# EAGLE design Schematic_11_2017 - 3Layersv7.2 (EAGLE 9.4.2)
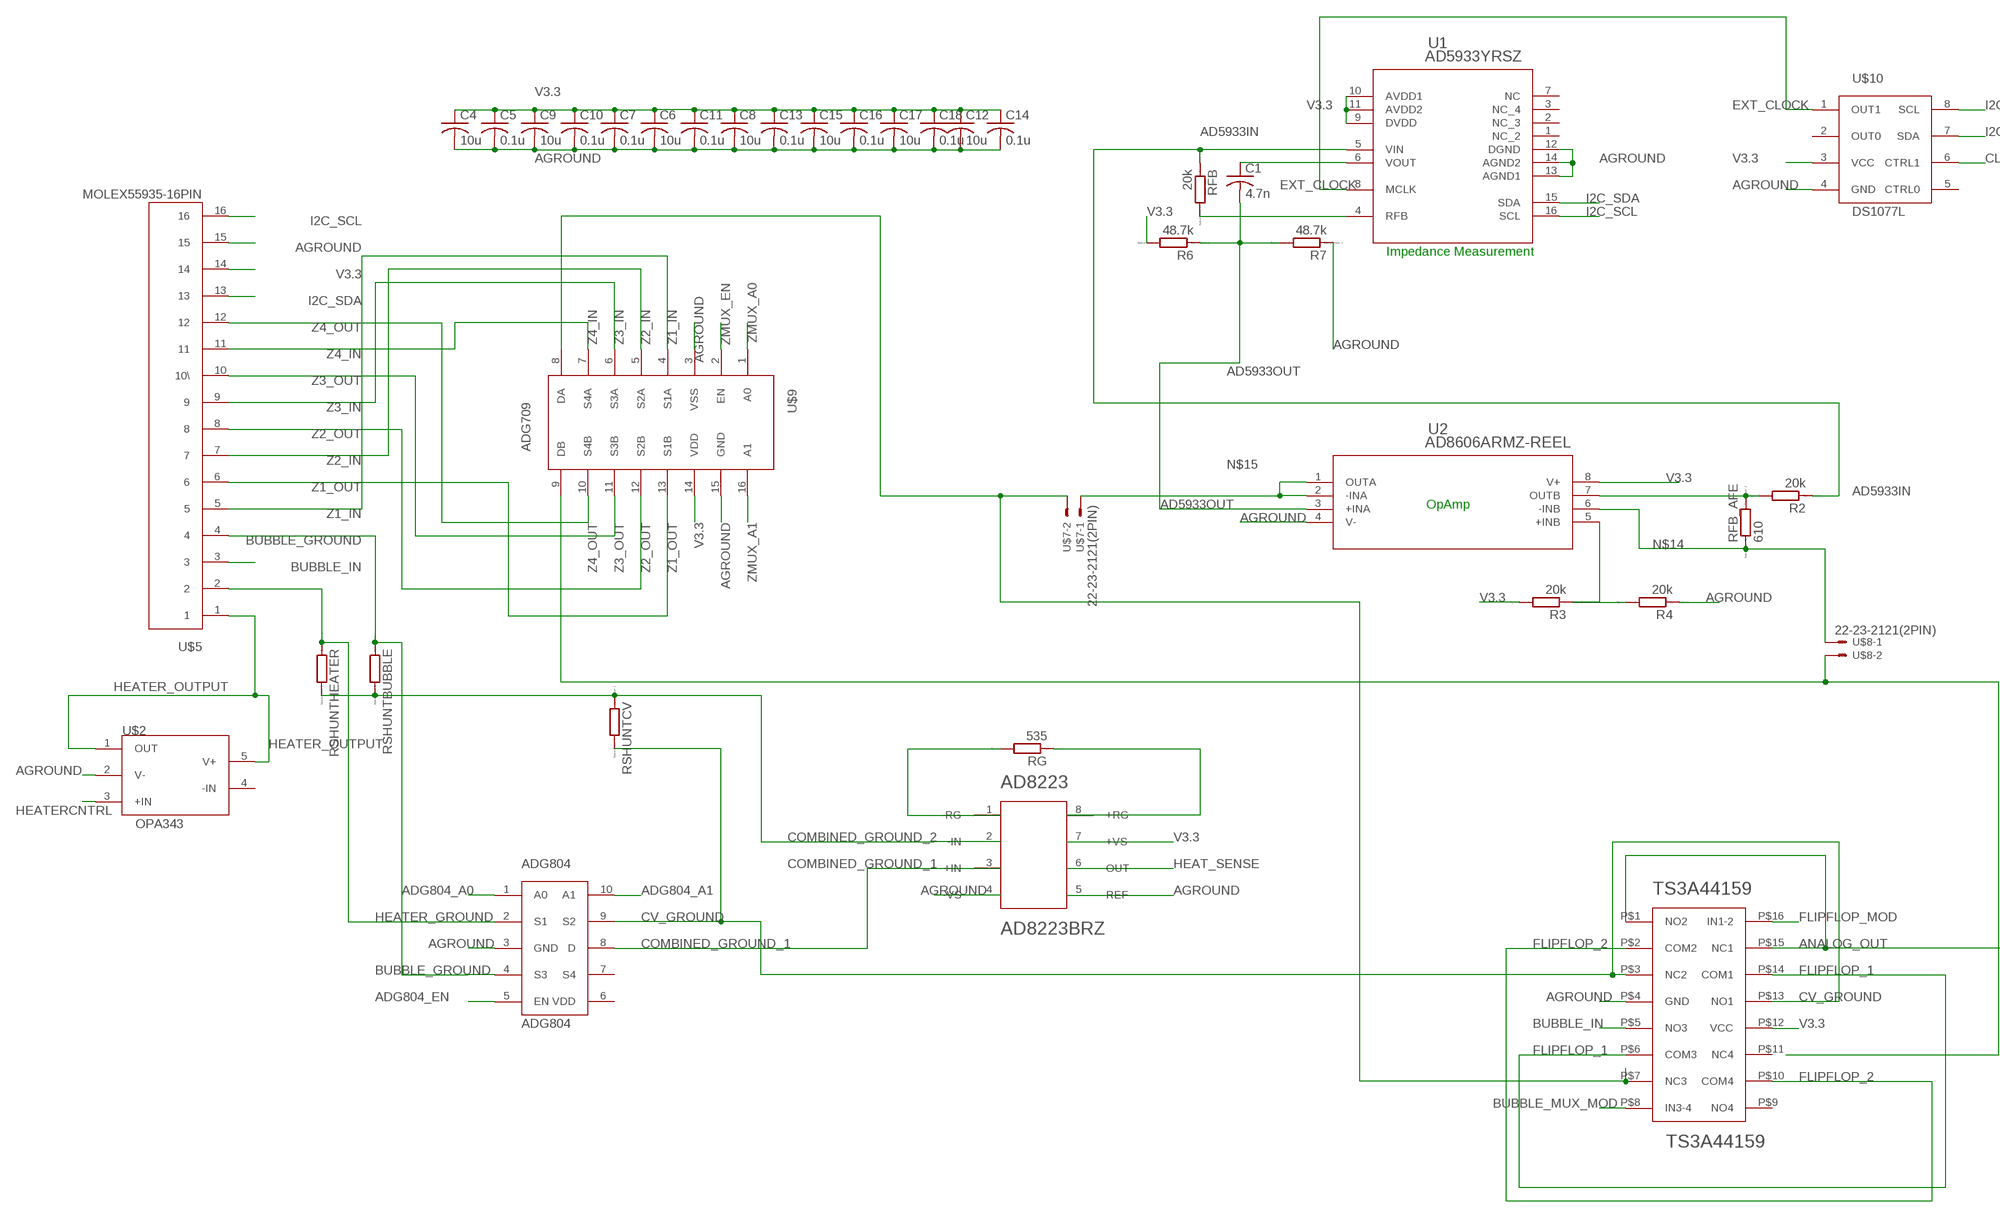
[diagram p0: schematic, sheet 1, part 1 of 2]
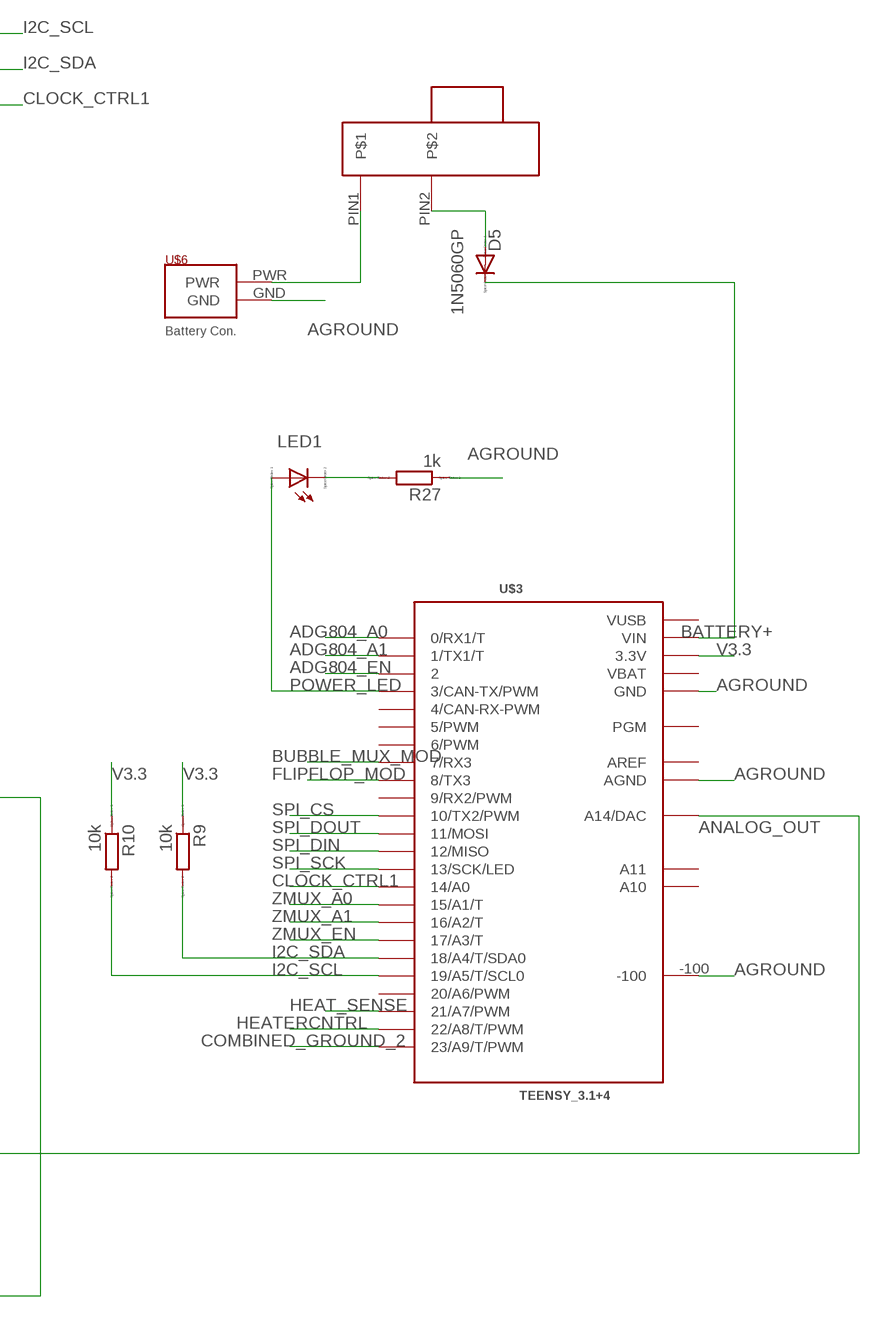
[diagram p1: schematic, sheet 1, part 2 of 2]

## Parts
ADG804  ADG804  [MSOP10]
C1  4.7n  C-USC1206  [C1206]
C4  10u  C-USC1206  [C1206]
C5  0.1u  C-USC1206  [C1206]
C6  10u  C-USC1206  [C1206]
C7  0.1u  C-USC1206  [C1206]
C8  10u  C-USC1206  [C1206]
C9  10u  C-USC1206  [C1206]
C10  0.1u  C-USC1206  [C1206]
C11  0.1u  C-USC1206  [C1206]
C12  10u  C-USC1206  [C1206]
C13  0.1u  C-USC1206  [C1206]
C14  0.1u  C-USC1206  [C1206]
C15  10u  C-USC1206  [C1206]
C16  0.1u  C-USC1206  [C1206]
C17  10u  C-USC1206  [C1206]
C18  0.1u  C-USC1206  [C1206]
D5  1N5060GP  [DO15-12]
LED1  LED_ELD260  [LED_LD260]
R2  20k  RR1206  [R1206]
R3  20k  RR1206  [R1206]
R4  20k  RR1206  [R1206]
R6  48.7k  RR1206  [R1206]
R7  48.7k  RR1206  [R1206]
R9  10k  RR1206  [R1206]
R10  10k  RR1206  [R1206]
R27  1k  RR1206  [R1206]
RFB  20k  RR1206  [R1206]
RFB_AFE  610  RR1206  [R1206]
RG  535  RR1206  [R1206]
RSHUNTBUBBLE  RR1206  [R1206]
RSHUNTCV  RR1206  [R1206]
RSHUNTHEATER  RR1206  [R1206]
TS3A44159  TS3A44159  [TSSOP16]
U1  AD5933YRSZ  [RS_16]
U2  AD8606ARMZ-REEL  [RM_8]
U$1  AD8223BRZ  [R-8]
U$2  OPA343  [SOT95P280X145-5N]
U$3  TEENSY_3.1+4  [TEENSY_3.1+4]
U$4  C&KSWITCH  [2POS_SWITCH]
U$5  MOLEX55935-16PIN  [MOLEX55935-16PIN]
U$6  PH_2PIN  [JST_PH_2PIN]
U$7  22-23-2121(2PIN)  [22-23-2121(2PIN)]
U$8  22-23-2121(2PIN)  [22-23-2121(2PIN)]
U$9  ADG709  [TSSOP16]
U$10  DS1077L  [SO08]

## Nets
AD5933IN: R2.1 RFB.1 U1.5(VIN)
AD5933OUT: C1.2 R6.1 R7.2 U2.3(+INA)
ADG804_A0: ADG804.1(A0) U$3.0(0/RX1/T)
ADG804_A1: ADG804.10(A1) U$3.1(1/TX1/T)
ADG804_EN: ADG804.5(EN) U$3.2
AGROUND: ADG804.3(GND) C4.2 C5.2 C6.2 C7.2 C8.2 C9.2 C10.2 C11.2 C12.2 C13.2 C14.2 C15.2 C16.2 C17.2 C18.2 R4.1 R7.1 R27.1 TS3A44159.P$4(GND) U1.12(DGND) U1.13(AGND1) U1.14(AGND2) U2.4(V-) U$1.4(-VS) U$1.5(REF) U$2.2(V-) U$3.-100 U$3.AGND U$3.GND1(GND) U$5.15 U$6.GND U$9.3(VSS) U$9.15(GND) U$10.4(GND)
ANALOG_OUT: TS3A44159.P$1(NO2) TS3A44159.P$15(NC1) U$3.A14(A14/DAC)
BATTERY+: D5.C U$3.VIN
BUBBLE_GROUND: ADG804.4(S3) RSHUNTBUBBLE.1 U$5.4
BUBBLE_IN: TS3A44159.P$5(NO3) U$5.3
BUBBLE_MUX_MOD: TS3A44159.P$8(IN3-4) U$3.7(7/RX3)
CLOCK_CTRL1: U$3.14/A0 U$10.6(CTRL1)
COMBINED_GROUND_1: ADG804.8(D) U$1.3(+IN)
COMBINED_GROUND_2: RSHUNTBUBBLE.2 RSHUNTCV.1 RSHUNTHEATER.2 U$1.2(-IN) U$3.23/A9(23/A9/T/PWM)
CV_GROUND: ADG804.9(S2) RSHUNTCV.2 TS3A44159.P$3(NC2) TS3A44159.P$13(NO1)
EXT_CLOCK: U1.8(MCLK) U$10.1(OUT1)
FLIPFLOP_1: TS3A44159.P$6(COM3) TS3A44159.P$14(COM1)
FLIPFLOP_2: TS3A44159.P$2(COM2) TS3A44159.P$10(COM4)
FLIPFLOP_MOD: TS3A44159.P$16(IN1-2) U$3.8(8/TX3)
HEAT_SENSE: U$1.6(OUT) U$3.21/A7(21/A7/PWM)
HEATER_GROUND: ADG804.2(S1) RSHUNTHEATER.1 U$5.2
HEATER_OUTPUT: U$2.1(OUT) U$2.5(V+) U$5.1
HEATERCNTRL: U$2.3(+IN) U$3.22/A8(22/A8/T/PWM)
I2C_SCL: R10.2 U1.16(SCL) U$3.19/A5(19/A5/T/SCL0) U$5.16 U$10.8(SCL)
I2C_SDA: R9.2 U1.15(SDA) U$3.18/A4(18/A4/T/SDA0) U$5.13 U$10.7(SDA)
N$1: U$4.PIN1 U$6.PWR
N$2: D5.A U$4.PIN2
N$4: RFB.2 U1.4(RFB)
N$5: LED1.K(C) R27.2
N$8: C1.1 U1.6(VOUT)
N$12: R2.2 RFB_AFE.2 U2.7(OUTB)
N$13: R3.1 R4.2 U2.5(+INB)
N$14: RFB_AFE.1 U2.6(-INB) U$8.1
N$15: U2.1(OUTA) U2.2(-INA) U$7.1
N$16: RG.2 U$1.1(-RG)
N$17: RG.1 U$1.8(+RG)
POWER_LED: LED1.A U$3.3(3/CAN-TX/PWM)
SIGNAL+: TS3A44159.P$7(NC3) U$7.2 U$9.8(DA)
SIGNAL-: U$8.2 U$9.9(DB)
SPI_CS: U$3.10(10/TX2/PWM)
SPI_DIN: U$3.12(12/MISO)
SPI_DOUT: U$3.11(11/MOSI)
SPI_SCK: U$3.13(13/SCK/LED)
V3.3: C4.1 C5.1 C6.1 C7.1 C8.1 C9.1 C10.1 C11.1 C12.1 C13.1 C14.1 C15.1 C16.1 C17.1 C18.1 R3.2 R6.2 R9.1 R10.1 TS3A44159.P$12(VCC) U1.9(DVDD) U1.10(AVDD1) U1.11(AVDD2) U2.8(V+) U$1.7(+VS) U$3.3.3V U$3.3.3V1(3.3V) U$5.14 U$9.14(VDD) U$10.3(VCC)
Z1_IN: U$5.5 U$9.4(S1A)
Z1_OUT: U$5.6 U$9.13(S1B)
Z2_IN: U$5.7 U$9.5(S2A)
Z2_OUT: U$5.8 U$9.12(S2B)
Z3_IN: U$5.9 U$9.6(S3A)
Z3_OUT: U$5.10(10\) U$9.11(S3B)
Z4_IN: U$5.11 U$9.7(S4A)
Z4_OUT: U$5.12 U$9.10(S4B)
ZMUX_A0: U$3.15/A1(15/A1/T) U$9.1(A0)
ZMUX_A1: U$3.16/A2(16/A2/T) U$9.16(A1)
ZMUX_EN: U$3.17/A3(17/A3/T) U$9.2(EN)
Unconnected: ADG804.6(VDD) ADG804.7(S4) TS3A44159.P$9(NO4) TS3A44159.P$11(NC4) U1.1(NC_2) U1.2(NC_3) U1.3(NC_4) U1.7(NC) U$2.4(-IN) U$3.4(4/CAN-RX-PWM) U$3.5(5/PWM) U$3.6(6/PWM) U$3.9(9/RX2/PWM) U$3.20/A6(20/A6/PWM) U$3.A10 U$3.A11 U$3.PGM U$10.2(OUT0) U$10.5(CTRL0)

## Notes on the sheet
- Impedance Measurement
- OpAmp

## Power pins joined to a net without a drawn wire
AREF: U$3.AREF
VBAT: U$3.VBAT
VUSB: U$3.VUSB

## Library data of the parts
ADG804 = analog_devices_gaui:ADG804
C1 C4-C18 = resistor:C-US: CAPACITOR, American symbol
D5 = diode:1N5060GP: DIODE controlled avalanche rectifier
LED1 = eagle-ltspice:LED_E: LED Source: http://www.osram.convergy.de Source: www.luxeon.com Source: www.kingbright.com; SPICEMODEL: NONE; SPICEPREFIX: D; SPICETYPE: diode
R2-R4 R6 R7 R9 R10 R27 RFB RFB_AFE RG RSHUNTBUBBLE RSHUNTCV RSHUNTHEATER = eagle-ltspice:R: RESISTOR, European symbol; SPICEMODEL: NONE; SPICEPREFIX: R
TS3A44159 = Z_analyze:TS3A44159
U1 = AD5933-impedance:AD5933YRSZ; MANUFACTURER_PART_NUMBER: AD5933YRSZ; VENDOR: Analog Devices Inc
U2 = AD8606-OpAmp:AD8606ARMZ-REEL; MANUFACTURER_PART_NUMBER: AD8606ARMZREEL; VENDOR: Analog Devices Inc
U$1 = Z_analyze:AD8223BRZ
U$2 = OPA343:OPA343: Rail-to-rail, single supply op amp, Texas Instruments
U$3 = Teensy_3_Series_Board_v1.0:TEENSY_3.1+4: Footprint for Teensy 3.1 board using all through-holes, i.e. the entire perimeter plus the 4 through-holes inboard (A10,A11,AREF, VUSB)
U$4 = 2pos_switch:C&KSWITCH
U$5 = Z_analyze:MOLEX55935-16PIN
U$6 = JST PH Connector:PH_2PIN
U$7 U$8 = con-molex:22-23-2121(2PIN)
U$9 = analog-devices-3 (1):ADG709
U$10 = analog_devices_gaui:DS1077L

## Board
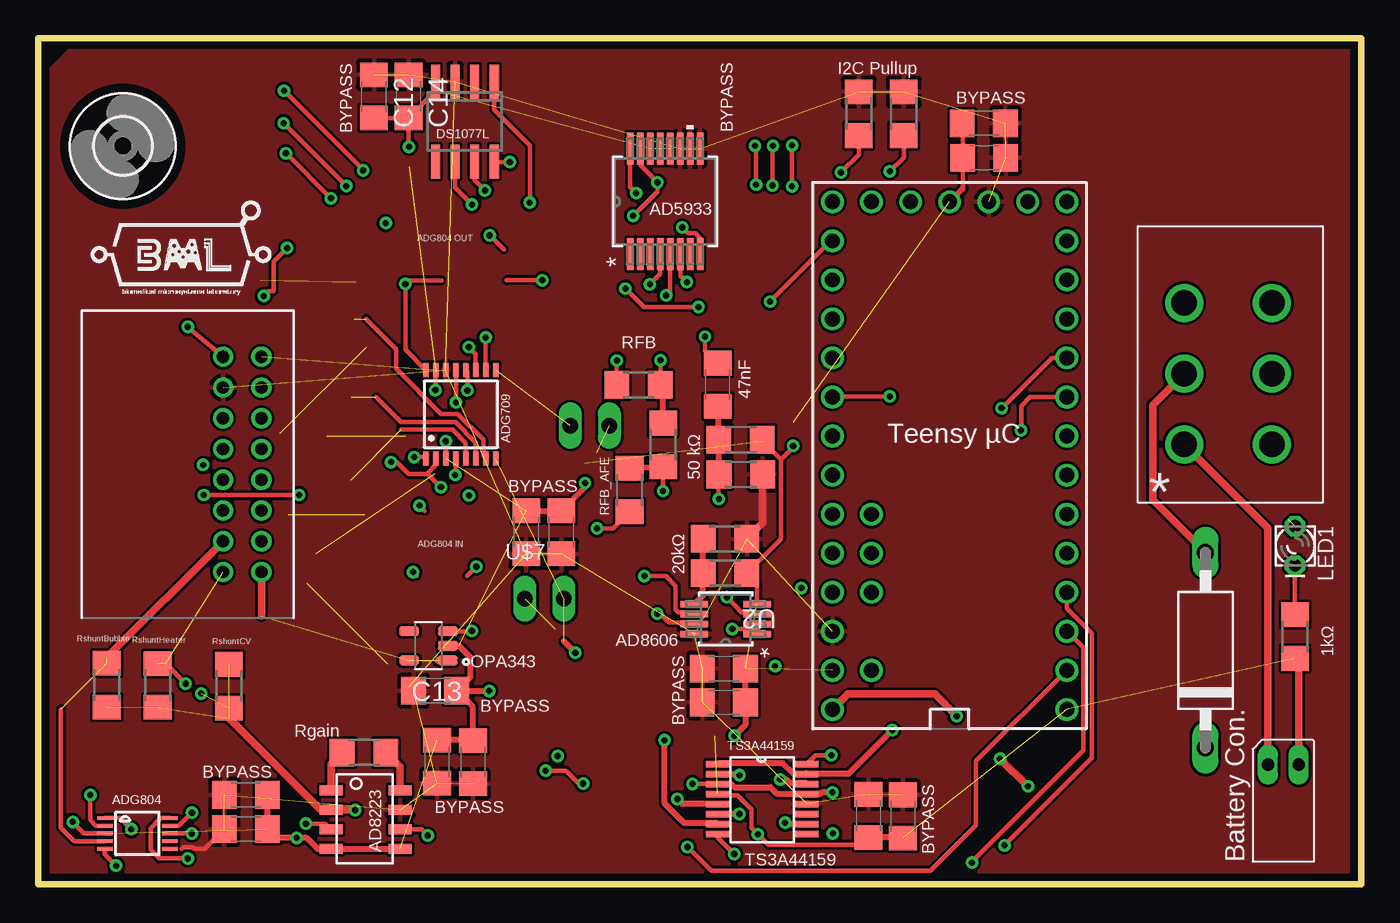
[diagram p2: board, top side]
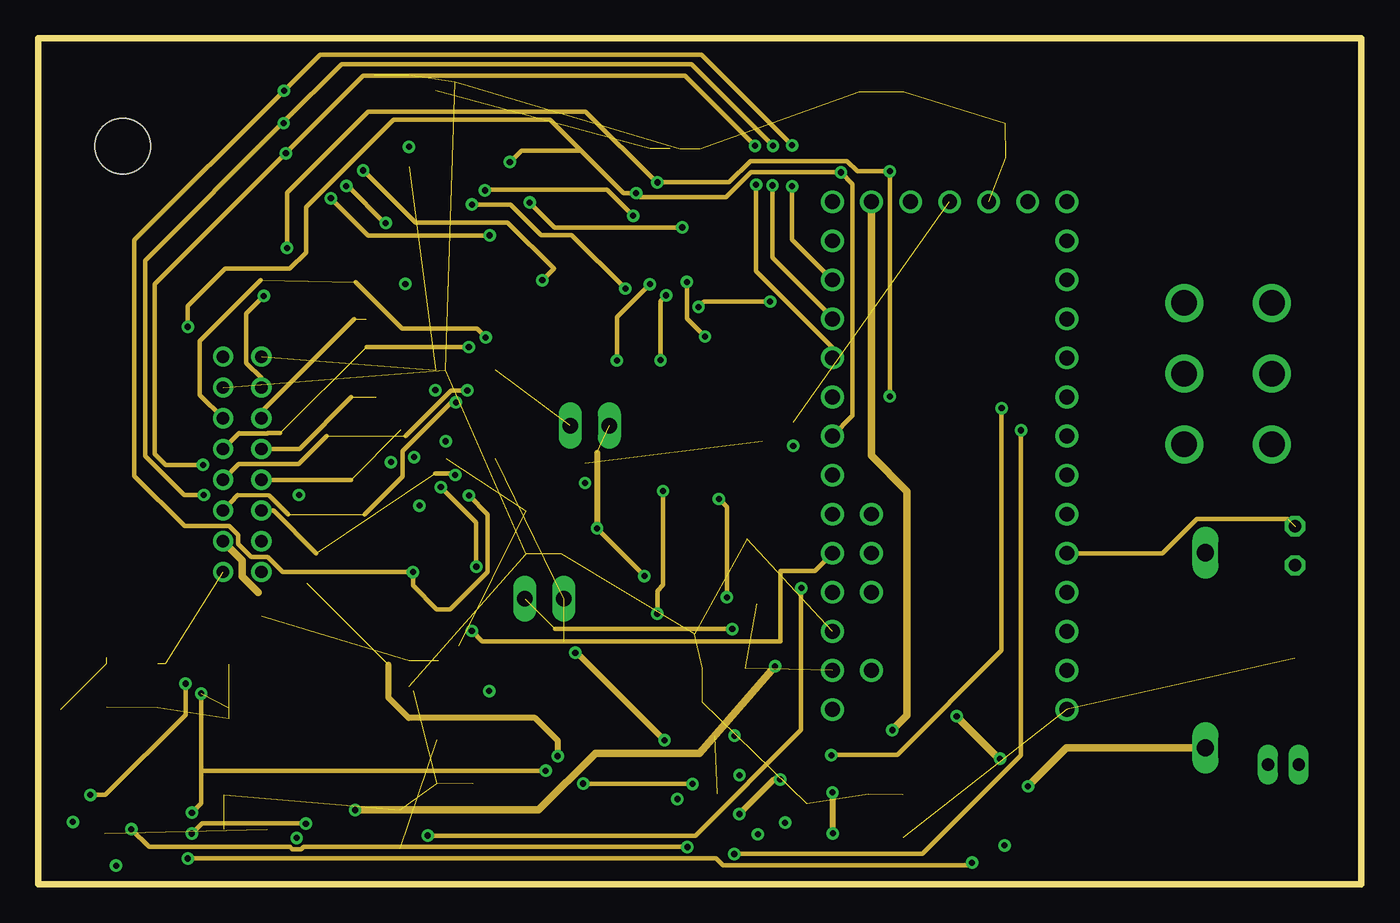
[diagram p3: board, inner layer Signal]
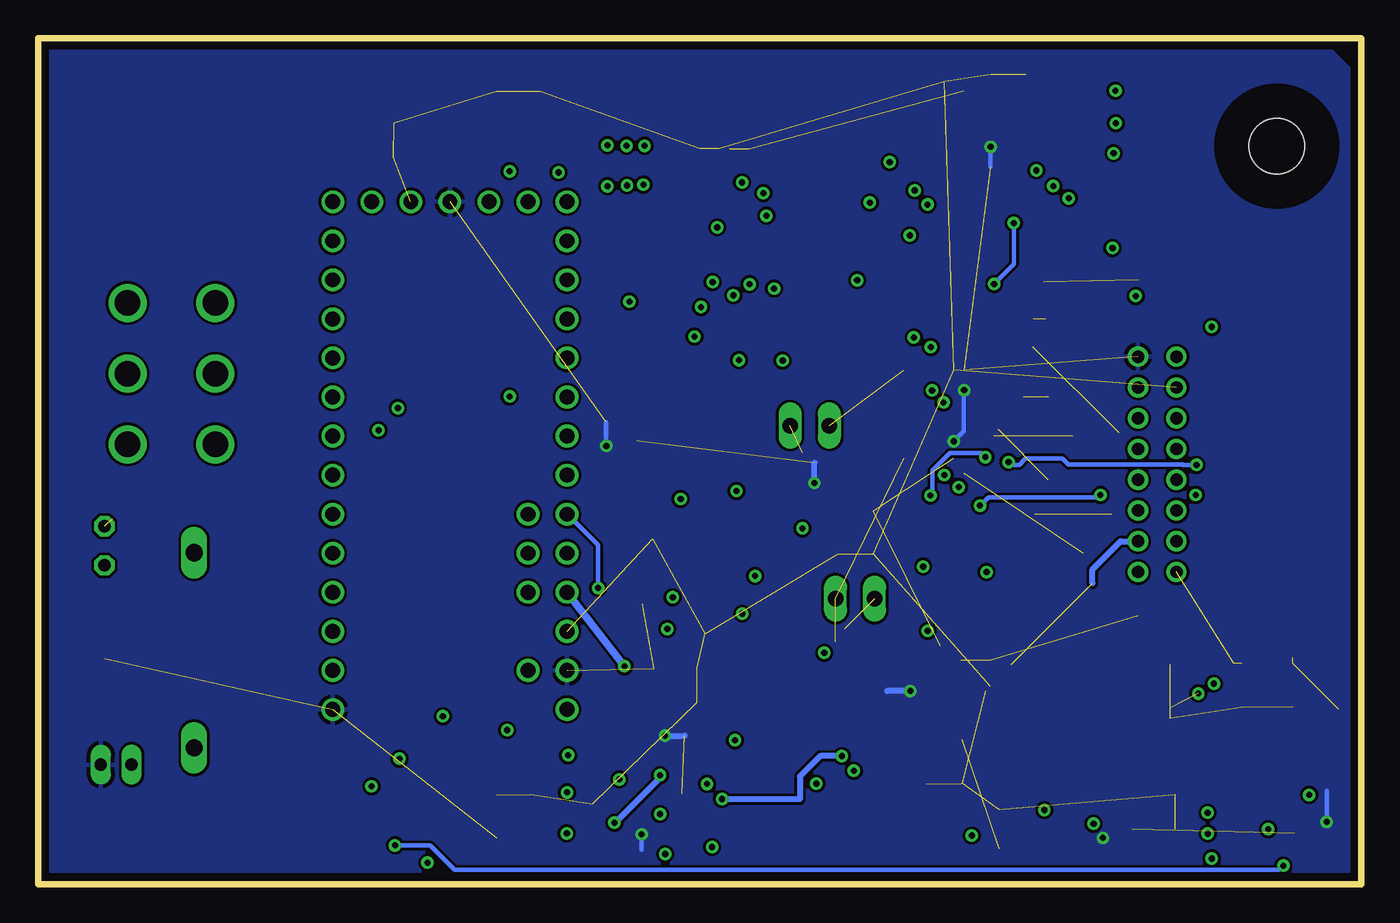
[diagram p4: board, bottom side, seen from below]

Size 86 x 55 mm. Coordinates in mm from the lower left corner, seen from the top.
Outline: 0,0 86,0 86,55 0,55 0,0
Copper layers (1+2*15+16): power 1mm / dielectric 1.5mm / Signal 0mil / dielectric 0.15mm / Route15 0.035mm / dielectric 0.2mm / ground 1mm
Design rules "default *": minimum track width 7mil, minimum drill 15mil, track to track 7mil, track to pad 7mil, pad to pad 7mil, via to via 7mil, smd to smd 4mil, copper to edge 20mil, drill to drill 4mil, minimum pad ring 10mil, minimum via ring 8mil, stop-mask expansion 4mil, vias tented up to drill 0mil, thermal gap 10mil

### Footprints (pad centres in the part's own frame; a part is rotated, then mirrored left to right if it is on the bottom)
MSOP10 = smd 0.25 x 1: 1 -1,-2.113; 2 -0.5,-2.113; 3 0,-2.113; 4 0.5,-2.113; 5 1,-2.113; 6 1,2.113; 7 0.5,2.113; 8 0,2.113; 9 -0.5,2.113; 10 -1,2.113
C1206 = smd 1.6 x 1.8: 1 -1.4,0; 2 1.4,0
DO15-12 = drill 1.118 long: A 6.35,0; C -6.35,0
3,6 = hole 3.6: 0,0
LED_LD260 = drill 0.813 octagon: A -1.27,0; K 1.27,0
R1206 = smd 1.6 x 1.803: 1 -1.422,0; 2 1.422,0
TSSOP16 = smd 1.5 x 0.45: P$1 0,0; P$2 0,-0.65; P$3 0,-1.3; P$4 0,-1.95; P$5 0,-2.6; P$6 0,-3.25; P$7 0,-3.9; P$8 0,-4.55; P$9 5.8,-4.55; P$10 5.8,-3.9; P$11 5.8,-3.25; P$12 5.8,-2.6; P$13 5.8,-1.95; P$14 5.8,-1.3; P$15 5.8,-0.65; P$16 5.8,0
RS_16 = smd 2.057 x 0.432: 1 -3.429,2.275; 2 -3.429,1.625; 3 -3.429,0.975; 4 -3.429,0.325; 5 -3.429,-0.325; 6 -3.429,-0.975; 7 -3.429,-1.625; 8 -3.429,-2.275; 9 3.429,-2.275; 10 3.429,-1.625; 11 3.429,-0.975; 12 3.429,-0.325; 13 3.429,0.325; 14 3.429,0.975; 15 3.429,1.625; 16 3.429,2.275
RM_8 = smd 1.778 x 0.432: 1 -2.045,0.975; 2 -2.045,0.325; 3 -2.045,-0.325; 4 -2.045,-0.975; 5 2.045,-0.975; 6 2.045,-0.325; 7 2.045,0.325; 8 2.045,0.975
R-8 = smd 0.65 x 1.5: 1 0,0; 2 1.27,0; 3 2.54,0; 4 3.81,0; 5 3.81,4.5; 6 2.54,4.5; 7 1.27,4.5; 8 0,4.5
SOT95P280X145-5N = smd 1.27 x 0.635: 1 -1.255,0.95; 2 -1.255,0; 3 -1.255,-0.95; 4 1.255,-0.95; 5 1.255,0.95
TEENSY_3.1+4 = drill 0.965: 0 -7.62,15.24; 1 -7.62,12.7; 2 -7.62,10.16; 3 -7.62,7.62; 3.3V 7.62,12.7; 3.3V1 -2.54,-15.24; 4 -7.62,5.08; 5 -7.62,2.54; 6 -7.62,0; 7 -7.62,-2.54; 8 -7.62,-5.08; 9 -7.62,-7.62; 10 -7.62,-10.16; 11 -7.62,-12.7; 12 -7.62,-15.24; 13 7.62,-15.24; 14/A0 7.62,-12.7; 15/A1 7.62,-10.16; 16/A2 7.62,-7.62; 17/A3 7.62,-5.08; 18/A4 7.62,-2.54; 19/A5 7.62,0; 20/A6 7.62,2.54; 21/A7 7.62,5.08; 22/A8 7.62,7.62; 23/A9 7.62,10.16; -100 -7.62,17.78; A10 5.08,7.62; A11 5.08,5.08; A14 5.08,-15.24; AGND 7.62,15.24; AREF 5.08,10.16; GND1 0,-15.24; PGM 2.54,-15.24; VBAT -5.08,-15.24; VIN 7.62,17.78; VUSB 5.08,15.24
2POS_SWITCH = drill 1.65: P$1 0,0; P$4 5.7,0; P$5 5.7,-4.6; P$6 5.7,-9.2; PIN1 0,-9.2; PIN2 0,-4.6
MOLEX55935-16PIN = drill 0.8: 1 0,0; 2 0,2.5; 3 2,0; 4 2,2.5; 5 4,0; 6 4,2.5; 7 6,0; 8 6,2.5; 9 8,0; 10 8,2.5; 11 10,0; 12 10,2.5; 13 12,0; 14 12,2.5; 15 14,0; 16 14,2.5
JST_PH_2PIN = drill 0.8 long: GND 0,-1; PWR 0,1
22-23-2121(2PIN) = drill 1 long: 1 -13.97,0; 2 -11.43,0
TSSOP16' = smd 0.9 x 0.35: 1 -2.875,2.275; 2 -2.875,1.625; 3 -2.875,0.975; 4 -2.875,0.325; 5 -2.875,-0.325; 6 -2.875,-0.975; 7 -2.875,-1.625; 8 -2.875,-2.275; 9 2.875,-2.275; 10 2.875,-1.625; 11 2.875,-0.975; 12 2.875,-0.325; 13 2.875,0.325; 14 2.875,0.975; 15 2.875,1.625; 16 2.875,2.275
SO08 = smd 0.6 x 2.2: 1 -1.905,-2.6; 2 -0.635,-2.6; 3 0.635,-2.6; 4 1.905,-2.6; 5 1.905,2.6; 6 0.635,2.6; 7 -0.635,2.6; 8 -1.905,2.6

### Placement (x,y rotation side)
ADG804  6.43,3.3 270 top
C1  44.16,32.49 270 top
C4  56.21,4.41 270 top
C5  53.97,4.44 270 top
C6  44.57,11.82 0 top
C7  44.57,14.02 0 top
C8  13.48,3.58 0 top
C9  31.72,22.88 90 top
C10  34,22.88 90 top
C11  13.49,5.81 0 top
C12  21.81,51.23 270 top
C13  25.79,12.58 0 top
C14  24.07,51.23 270 top
C15  28.26,7.93 90 top
C16  25.92,7.97 90 top
C17  61.47,49.48 180 top
C18  61.5,47.24 180 top
D5  75.88,15.21 90 top
H1  MOUNT-HOLE3.6  [3,6]  5.49,48 0 top
LED1  81.71,22 270 top
R2  40.62,28.57 270 top
R3  44.64,22.46 0 top
R4  44.64,20.23 180 top
R6  45.67,26.64 0 top
R7  45.65,28.9 180 top
R9  56.26,50.1 270 top
R10  53.34,50.1 270 top
R27  81.7,16.1 90 top
RFB  39.02,32.47 180 top
RFB_AFE  38.43,25.63 90 top
RG  21.17,8.56 180 top
RSHUNTBUBBLE  4.44,12.94 270 top
RSHUNTCV  12.39,12.87 270 top
RSHUNTHEATER  7.76,12.93 270 top
TS3A44159  44.16,7.81 0 top
U1  40.75,44.4 90 top
U2  44.69,17.24 180 top
U$1  19.02,6.1 270 top
U$2  25.36,15.5 180 top
U$3  59.25,29.14 180 top
U$4  74.5,37.8 0 top
U$5  14.5,20.3 90 top
U$6  80.95,7.77 90 top
U$7  45.6,18.56 0 top
U$8  23.15,29.82 180 top
U$9  ADG709  [TSSOP16']  27.46,30.56 90 top
U$10  27.73,49.59 180 top

### Tracks (layer width: path | path; a pad name or v marks a point on that pad's centre or on a via)
AD5933IN  (via drill 0.4)
  power 0.3: RFB.1 v40.44,34.07 arc-90 v40.45,34.08 | v40.81,38.29 41.08,38.55 U1.5
  power 0.4: R2.1 40.62,32.29 arc90 RFB.1
  Signal 0.3: v40.45,34.08 40.45,37.93 v40.81,38.29
AD5933OUT  (via drill 0.4)
  power 0.3: U2.3 46.63,17.67 45.71,17.67 45.52,17.86 45.52,17.89 v44.76,18.65 | v44.24,25.05 arc-12 R6.1
  power 0.4: R6.1 44.25,28.88 arc90 R7.2 44.23,31.02 arc90 C1.2
  Signal 0.3: v44.76,18.65 44.76,24.53 v44.24,25.05
ADG804_A0  (via drill 0.4)
  power 0.3: U$3.0 60.97,8 60.97,3.82 58.01,0.86 43.76,0.86 v42.2,2.42 | v6.04,3.57 5.31,4.3 ADG804.1
  Signal 0.3: v42.2,2.42 17.23,2.42 17.09,2.28 16.49,2.28 16.35,2.42 7.19,2.42 v6.04,3.57
ADG804_A1  (via drill 0.4)
  power 0.3: U$3.1 66.89,16.44 67.93,15.4 67.93,8.69 60.7,1.46 v60.7,1.4 | v9.71,1.67 7.85,1.67 7.29,2.23 7.29,3.63 7.96,4.3 ADG804.10
  Signal 0.3: v60.7,1.4 60.52,1.22 44.5,1.22 44.05,1.67 v9.71,1.67
ADG804_EN  (via drill 0.4)
  power 0.3: U$3.2 66.87,17.95 68.51,16.3 68.51,8.21 v62.81,2.52 | v5.05,1.2 4.32,1.93 ADG804.5
  ground 0.3: v62.81,2.52 60.54,2.52 58.94,0.92 5.33,0.92 v5.05,1.2
AGROUND  (via drill 0.4)  (16 unrouted)
  power 0.3: R7.1 47.07,28.82 48.27,27.63 | 48.27,27.63 48.27,22.44 R4.1 46.73,19.56 U2.4 | 48.27,27.63 49.08,28.44 v49.08,28.5 | C5.2 53.48,2.55 47.47,2.55 v46.78,3.24 46.36,3.66 46.36,4.85 45.45,5.76 44.26,5.76 TS3A44159.P$4 | ADG804.3 2.96,3.3 2.24,4.02 v2.24,4.05 | U$9.15 25.84,32.16 v25.81,32.13 | v26.48,28.8 26.5,28.79 26.5,27.7 U$9.3 | C12.2 C14.2 | U$10.4 25.82,51.59 C14.2 | C14.2 24.07,47.97 v24.09,47.95 | 60.1,45.23 C18.2 60.1,49.45
  power 0.38: C6.2 C7.2 | U$3.GND1 60.1,45.23 | 60.1,49.45 C17.2
  power 0.4: C9.2 C10.2 35.54,25.82 v35.54,26.09 | U$2.2 27.34,15.5 28.07,14.77 28.07,13.46 C13.2 | C15.2 28.22,9.37 | 28.22,9.37 C16.2 | C13.2 29.29,12.58 v29.31,12.56 | U$1.5 U$1.4 18.15,2.29 17.43,3.01 v16.79,3.01 15.45,3.01 C8.2 C11.2 | C4.2 56.18,3.04 C5.2 | C6.2 45.97,10.36 v45.26,9.65 | 28.22,9.37 28.22,11.55 C13.2
  power 0.5: U$6.GND 81.95,14.43 R27.1
  ground 0.3: v49.08,28.5 49.08,30.04 49.1,30.06 | v46.78,3.24 46.78,2.27 46.8,2.25 | v2.24,4.05 2.24,6.08 | v25.81,32.13 25.81,29.47 v26.48,28.8 | v24.09,47.95 24.09,46.67 24.11,46.65
  ground 0.4: v35.54,26.09 35.54,27.4 | v29.31,12.56 30.8,12.56 | v45.26,9.65 43.99,9.65 43.98,9.66
  pour ground: 0.35,52.57 0.35,0.33 85.69,0.33 85.69,54.7 2.47,54.7 0.35,52.58
ANALOG_OUT  (via drill 0.4)
  power 0.4: v55.52,10.02 52.66,7.16 TS3A44159.P$15 49.91,7.21 49.05,7.21 48.39,7.87 44.22,7.87 TS3A44159.P$1
  Signal 0.5: U$3.A14 54.17,27.86 56.48,25.55 56.48,10.98 v55.52,10.02
BATTERY+  (via drill 0.4)
  power 0.5: U$3.VIN 52.64,12.37 58.28,12.37 59.7,10.95 v59.7,10.92 | v62.52,8.16 64.32,6.36 v64.34,6.36
  Signal 0.5: v59.7,10.92 62.46,8.16 v62.52,8.16 | v64.34,6.36 66.84,8.86 D5.C
BUBBLE_GROUND  (2 unrouted)
  power 0.3: ADG804.4 2.33,2.8 1.45,3.68 1.45,11.37
  power 0.5: U$5.4 4.44,14.74
  Signal 0.5: U$5.4 13.25,21.05 13.25,20.02 14.3,18.97
BUBBLE_IN  (via drill 0.4)  (1 unrouted)
  power 0.4: TS3A44159.P$5 41.87,5.21 v41.55,5.53
  Signal 0.4: 22.75,14.29 22.75,12.14 24.08,10.81 32.3,10.81 33.76,9.35 v33.76,8.33
  ground 0.4: v33.76,8.33 35.16,8.33 36.49,7 36.49,5.53 v41.55,5.53 | U$5.3 15.65,22.3 17.47,20.48 17.47,19.57
BUBBLE_MUX_MOD  (via drill 0.4)
  power 0.3: TS3A44159.P$8 44.16,3.04 v45.24,1.96 | U$3.7 64.47,31.68 63.9,31.11 v63.9,29.53 v63.89,29.52
  Signal 0.3: v45.24,1.96 57.47,1.96 63.89,8.38 v63.89,29.52
CLOCK_CTRL1  (via drill 0.4)
  power 0.3: v38.17,38.73 38.18,38.73 39.37,37.54 v42.92,37.54 | U$3.14/A0 51.53,41.84 v47.57,37.88 | v28.19,44.2 27.09,45.3 U$10.6
  Signal 0.3: v38.17,38.73 v38.16,38.73 34.67,42.22 32.68,42.22 30.7,44.2 v28.19,44.2 | v47.57,37.88 43.26,37.88 v42.92,37.54
COMBINED_GROUND_1  (via drill 0.4)
  power 0.3: ADG804.8 v9.96,3.3 v9.97,3.29 | U$1.3 18.64,3.94 v17.39,3.94
  Signal 0.3: v9.97,3.29 10.63,3.96 17.38,3.96 v17.39,3.94
COMBINED_GROUND_2  (via drill 0.4)  (3 unrouted)
  power 0.5: v20.59,4.82 U$1.2 | U$1.2 | 12.39,10.78 18.35,4.82 U$1.2
  Signal 0.5: v47.9,14.17 42.97,8.51 36.21,8.51 32.52,4.82 v20.59,4.82
  ground 0.5: v47.9,14.17 U$3.23/A9
CV_GROUND  (via drill 0.4)  (1 unrouted)
  power 0.3: v42.53,6.52 arc90 v42.54,6.51 TS3A44159.P$3 | 10.58,12.48 v10.58,12.4 | v9.98,4.65 9.37,4.04 9.13,3.8 ADG804.9 | v35.42,6.54 35.14,6.54 34.3,7.38 v32.98,7.38
  power 0.38: TS3A44159.P$3 45.03,6.51 45.25,6.3 47.6,6.3 48.02,5.88 49.94,5.88 TS3A44159.P$13
  power 0.4: v51.63,5.97 50.92,5.97 50.83,5.87 TS3A44159.P$13 | v51.65,3.3 51.61,3.26
  Signal 0.3: v10.58,12.4 10.58,7.38 | 10.58,7.38 10.58,5.25 v9.98,4.65 | v42.53,6.52 35.44,6.52 v35.42,6.54 | v32.98,7.38 10.58,7.38
  Signal 0.4: v51.63,5.97 51.63,3.32 v51.65,3.3
EXT_CLOCK  (via drill 0.4)
  power 0.3: U$10.1 29.64,50.35 31.97,48.02 31.97,44.36 v31.94,44.33 | v41.86,42.71 42.24,42.33 42.73,42.33 43.02,42.03 U1.8
  Signal 0.3: v31.94,44.33 33.57,42.7 v41.85,42.7 v41.86,42.71
FLIPFLOP_1  (via drill 0.4)
  power 0.4: TS3A44159.P$14 49.91,6.56 48.89,6.56 48.63,6.81 v48.23,6.81 | v45.58,4.56 TS3A44159.P$6
  Signal 0.4: v48.23,6.81 47.83,6.81 v45.58,4.56
FLIPFLOP_2  (via drill 0.4)
  power 0.4: TS3A44159.P$2 45.51,7.16 v45.59,7.08 | v48.55,4 48.64,3.91 TS3A44159.P$10
  ground 0.4: v48.55,4 48.5,4 45.59,6.91 v45.59,7.08
FLIPFLOP_MOD  (via drill 0.4)
  power 0.3: v51.56,8.38 50.53,8.38 TS3A44159.P$16 | v62.63,30.96 65.89,34.22 U$3.8
  Signal 0.3: v51.56,8.38 51.6,8.42 55.85,8.42 62.62,15.19 v62.62,30.95 v62.63,30.96
HEAT_SENSE  (via drill 0.4)
  power 0.3: U$1.6 24.91,3.56 v25.31,3.16
  Signal 0.3: v49.61,19.26 arc90 49.58,19.23 49.58,10.03 42.71,3.16 v25.31,3.16
  ground 0.3: v49.61,19.26 49.63,19.28 49.63,22.06 U$3.21/A7
HEATER_GROUND  (via drill 0.4)  (2 unrouted)
  power 0.3: 8.26,14.35 v9.57,13.04 | v3.37,5.8 3.36,5.79 3.36,4.17 3.73,3.8 ADG804.2
  Signal 0.3: v9.57,13.04 9.57,11.02 4.35,5.8 v3.37,5.8
HEATER_OUTPUT  (2 unrouted)
  power 0.5: U$2.1 26,14.55 | 14.5,17.46 U$5.1
HEATERCNTRL  (via drill 0.4)
  power 0.3: v28.18,16.47 arc-90 28.16,16.45 U$2.3
  Signal 0.3: v28.18,16.47 28.85,15.8 48.25,15.8 48.25,20.38 50.49,20.38 U$3.22/A8
I2C_SCL  (via drill 0.4)
  power 0.3: U$5.16 v9.71,36.24 | U1.16 38.48,45.33 v38.86,44.94 | v52.18,46.29 53.34,47.45 R10.2 | v30.65,46.96 29.66,46.96 U$10.8
  Signal 0.3: U$3.19/A5 52.93,30.47 52.93,45.54 v52.18,46.29 46.32,46.29 44.72,44.69 39.11,44.69 v38.86,44.94 38.05,44.94 35.28,47.71 | v9.71,36.24 9.71,37.58 12.15,40.02 16.33,40.02 17.39,41.08 17.39,44.04 23.08,49.73 33.26,49.73 35.28,47.71 | 35.28,47.71 31.4,47.71 v30.65,46.96
I2C_SDA  (via drill 0.4)
  power 0.3: U1.15 39.14,47.81 39.14,46.75 v40.25,45.64 40.25,45.03 38.69,43.47 v38.67,43.47 | v55.36,46.36 56.26,47.26 R9.2 | v14.65,38.25 14.96,38.56 15.28,38.56 15.28,40.49 v16.16,41.37 | v55.36,31.72 51.67,31.72 U$3.18/A4 | v29.03,45.12 28.36,45.78 U$10.7
  Signal 0.3: v55.36,31.72 v55.36,46.36 53.25,46.36 52.58,47.03 46.3,47.03 44.91,45.64 v40.25,45.64 40.18,45.64 35.57,50.25 21.44,50.25 16.16,44.97 v16.16,41.37 | U$5.13 14.5,32.91 13.52,33.89 13.52,37.12 v14.65,38.25 | v29.03,45.12 29.03,45.16 36.98,45.16 v38.67,43.47
N$1
  power 0.5: U$4.PIN1 79.95,23.15 U$6.PWR
N$2
  power 0.5: D5.A 72.46,24.98 72.46,31.16 U$4.PIN2
N$4  (via drill 0.4)
  power 0.3: RFB.2 37.6,34.04 arc-90 v37.61,34.05 | v39.76,39.02 40.42,39.69 U1.4
  Signal 0.3: v37.61,34.05 37.61,36.87 v39.76,39.02
N$5
  power 0.3: LED1.K R27.2
N$8  (via drill 0.4)
  power 0.3: U1.6 41.76,40.97 41.76,39.56 v42.16,39.16 | C1.1 43.34,34.71 v43.34,35.61
  Signal 0.3: v43.34,35.61 42.16,36.79 v42.16,39.16
N$12  (via drill 0.4)
  power 0.3: U2.7 42.54,17.02 41.01,17.02 40.44,17.59 v40.24,17.59 | v40.61,25.57 40.61,27.14 R2.2
  power 0.4: RFB_AFE.2 R2.2
  Signal 0.3: v40.61,25.57 40.61,19.45 40.24,19.08 v40.24,17.59
N$13
  power 0.4: U2.5 43.22,18.79 R4.2 R3.1
N$14  (via drill 0.4)  (1 unrouted)
  power 0.3: v36.32,23.14 37.36,23.14 RFB_AFE.1 | v39.4,20.04 40.79,20.04 41.43,19.4 41.43,17.86 41.62,17.67 42.54,17.67 U2.6
  Signal 0.3: v36.32,23.14 v36.33,23.13 39.4,20.06 v39.4,20.04
  Signal 0.4: 36.33,28.07 v36.33,23.13
N$15  (via drill 0.4)  (1 unrouted)
  power 0.3: 46.73,16.59 v45.11,16.59
  power 0.4: U2.2 46.73,16.59 U2.1
  Signal 0.3: v45.11,16.59 v45.1,16.6 33.59,16.6
N$16
  power 0.5: U$1.1 19.02,7.83 RG.2
N$17
  power 0.5: U$1.8 23.52,7.63 RG.1
POWER_LED  (1 unrouted)
  Signal 0.3: 81.22,23.76 75.33,23.76 73.09,21.52 U$3.3
SIGNAL+  (via drill 0.4)  (2 unrouted)
  power 0.4: TS3A44159.P$7 44.11,3.96 41.99,3.96 40.71,5.24 v40.71,9.36 | v34.91,15.05 34.17,15.79
  Signal 0.4: v40.71,9.36 35.02,15.05 v34.91,15.05
SIGNAL-  (1 unrouted)
V3.3  (28 unrouted)
  power 0.3: C8.1 10.8,2.3 10.11,2.3 10.01,2.4 9.41,2.4 9.31,2.3
  power 0.5: R6.2 47.09,23.49 R3.2 | C13.1 24.11,12.87
  pour power: 0.36,52.52 0.36,0.34 85.68,0.33 85.68,54.7 2.52,54.7 0.36,52.54
Z1_IN  (via drill 0.4)  (1 unrouted)
  power 0.3: U$9.4 27.14,26.64 v27.1,26.61
  Signal 0.3: 18.07,21.51 15.28,24.3 U$5.5 | v27.1,26.61 27.01,26.7 25.8,26.7
Z1_OUT  (via drill 0.4)  (1 unrouted)
  power 0.3: U$9.13 27.14,33.42 v27.14,31.34 v27.15,31.33
  Signal 0.3: U$5.6 12.96,25.3 15,25.29 16.24,24.05 | v27.15,31.33 26.84,31.33 23.68,28.17 23.68,26.52 21.21,24.05
Z2_IN  (1 unrouted)
  power 0.3: U$9.5 27.79,28.7 26.93,29.56 23.58,29.56
  Signal 0.3: 20.32,26.3 U$5.7
Z2_OUT  (via drill 0.4)  (1 unrouted)
  power 0.3: U$9.12 27.89,33.33 v27.89,32.11
  Signal 0.3: 18.75,29.13 16.93,27.32 13.02,27.32 U$5.8 | v27.89,32.11 27.87,32.09 26.82,32.09 23.86,29.13
Z3_IN  (1 unrouted)
  power 0.3: U$9.6 28.44,28.73 27.12,30.05 23.59,30.05 21.97,31.67
  Signal 0.3: U$5.9 16.97,28.3 20.34,31.67
Z3_OUT  (via drill 0.4)  (1 unrouted)
  power 0.3: U$9.11 28.43,34.48 v27.98,34.93
  Signal 0.3: U$5.10 13.05,29.34 13.07,29.32 14.91,29.32 14.92,29.33 15.73,29.33 | v27.98,34.93 21.33,34.93
Z4_IN  (1 unrouted)
  power 0.3: U$9.7 28.94,27.83 28.94,28.9 27.27,30.58 26.19,30.58 23.25,33.52 23.25,34.81 21.31,36.75
  Signal 0.3: 20.52,36.75 14.5,30.73 U$5.11
Z4_OUT  (via drill 0.4)  (1 unrouted)
  power 0.3: U$9.10 v29.09,35.55 v29.08,35.55
  Signal 0.3: 14.45,39.29 10.48,35.32 10.48,31.82 U$5.12 | v29.08,35.55 28.51,36.12 23.63,36.12 20.61,39.14
ZMUX_A0  (via drill 0.4)
  power 0.3: v49,45.39 v49,48.05 | v24.35,20.3 24.59,20.06 | v15.97,51.6 21.11,46.46 v21.11,46.42 | v32.77,39.27 30.45,39.27 | v24.43,27.77 25.1,27.77 U$9.1
  Signal 0.3: U$3.15/A1 49,41.92 v49,45.39 | v49,48.05 43.12,53.93 18.3,53.93 v15.97,51.6 | v15.97,51.6 6.24,41.87 6.24,26.56 9.52,23.28 12.41,23.28 12.98,22.71 12.98,22.14 13.84,21.28 14.91,21.28 15.89,20.3 v24.35,20.3 24.35,19.42 25.89,17.88 26.78,17.88 29.21,20.31 29.21,24.05 v27.99,25.27 | v15.97,51.6 | v21.11,46.42 24.51,43.02 30.51,43.02 33.51,40.02 v32.77,39.27
  ground 0.3: v27.99,25.27 27.86,25.41 27.86,26.91 26.74,28.03 24.69,28.03 v24.43,27.77
ZMUX_A1  (via drill 0.4)
  power 0.3: v47.73,45.44 47.73,47.99 v47.76,48.02 | v10.75,25.31 v16.95,25.31 | v24.78,24.62 25.12,24.28 | v20.01,45.4 20.01,45.42 v15.94,49.49 | 26.2,39.26 24.09,39.26 v23.86,39.03 23.86,34.76 U$9.16
  Signal 0.3: U$3.16/A2 51.63,36.85 47.73,40.74 v47.73,45.44 | v47.76,48.02 42.46,53.32 19.7,53.32 15.93,49.55 | 15.93,49.55 6.93,40.55 6.93,27.85 9.47,25.31 v10.75,25.31 | 15.93,49.55 15.94,49.53 v15.94,49.49 | v20.01,45.4 20.12,45.4 22.52,43 v22.58,43
  ground 0.3: v16.95,25.31 17.1,25.16 24.24,25.16 v24.78,24.62 | v22.58,43 22.58,40.31 v23.86,39.03
ZMUX_EN  (via drill 0.4)
  power 0.3: v46.66,45.49 46.66,47.95 v46.59,48.02 | 25.26,26.67 24.07,26.67 23.29,27.45 v22.92,27.45 | 25.26,26.67 25.84,27.25 U$9.2 | 25.26,26.67 25.31,26.67 v26.16,25.82 | v28.47,20.65 27.88,20.06 | v16.09,47.53 v19.01,44.61 | v29.34,42.19 v29.35,42.19 30.26,41.28
  Signal 0.3: U$3.17/A3 51.63,34.91 46.66,39.88 v46.66,45.49 | v46.59,48.02 42.03,52.58 21.11,52.58 16.09,47.55 | 16.09,47.55 7.57,39.04 7.57,27.97 8.27,27.27 v10.7,27.27 | v26.16,25.82 28.47,23.51 v28.47,20.65 | 16.09,47.55 v16.09,47.53 | v19.01,44.61 21.43,42.19 v29.34,42.19
  ground 0.3: v22.92,27.45 22.74,27.27 22.21,27.27 21.81,27.67 19.41,27.67 19.02,27.28 11.59,27.28 11.58,27.27 v10.7,27.27

### Text on the board
tPlace: BYPASS | I2C Pullup | BYPASS | BYPASS | DS1077L | AD5933 | ADG804 OUT | RFB | 47nF | ADG709 | Teensy µC | RFB_AFE | 50 kΩ | BYPASS | 20kΩ | ADG804 IN | RshuntBubble | RshuntHeater | RshuntCV | AD8606 | 1kΩ | OPA343 | BYPASS | Rgain | BYPASS | BYPASS | AD8223 | BYPASS | TS3A44159 | BYPASS